# Altium schematic sheet fullCURRENT smarts micro.SchDoc
size C
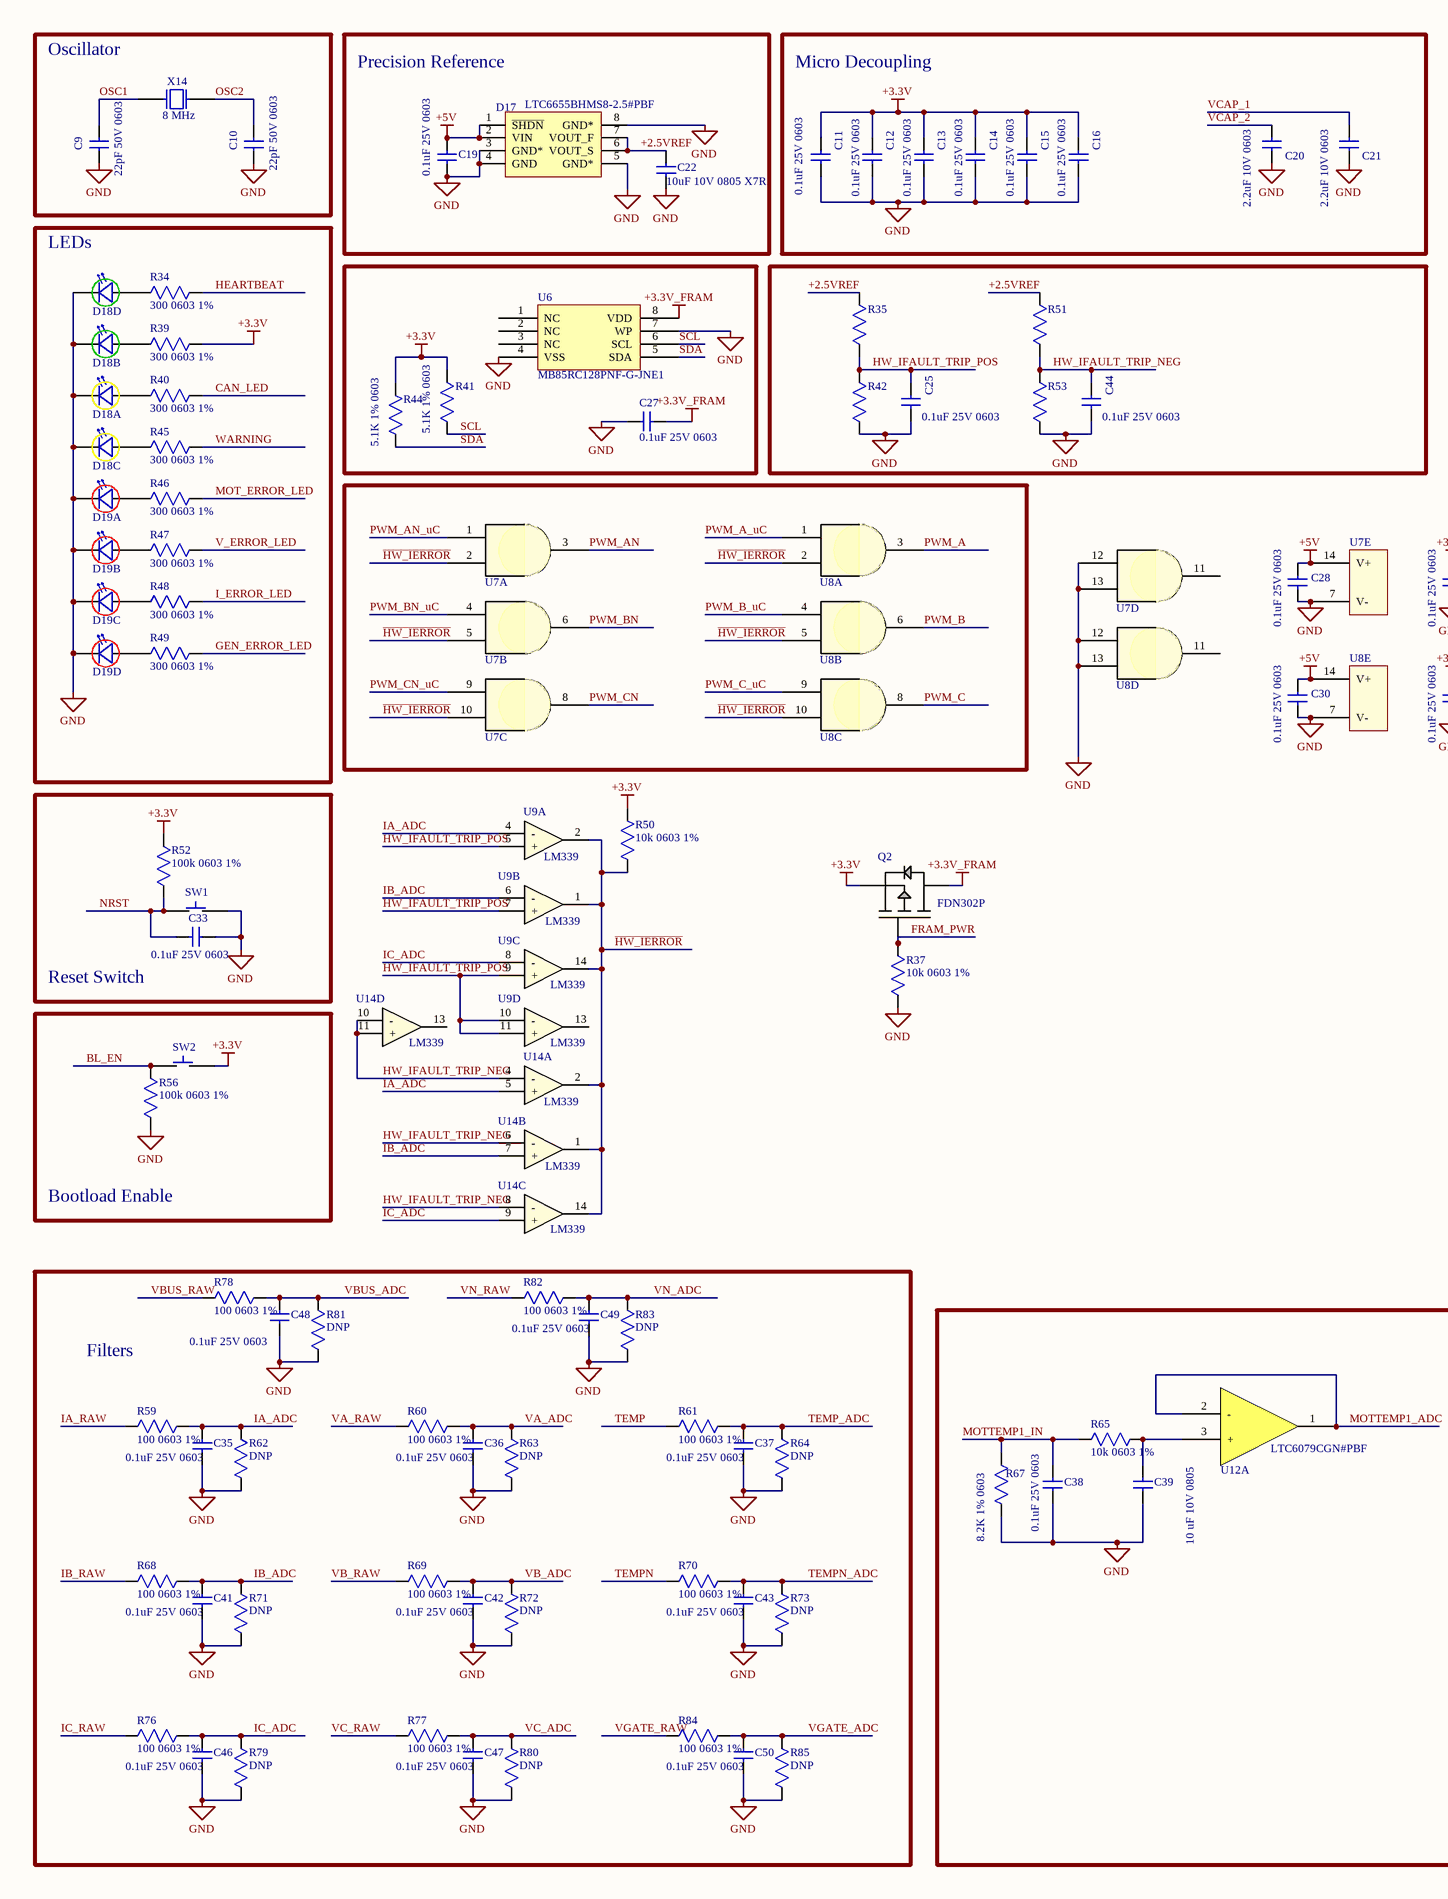
[diagram p0: fullCURRENT smarts micro.SchDoc, left]
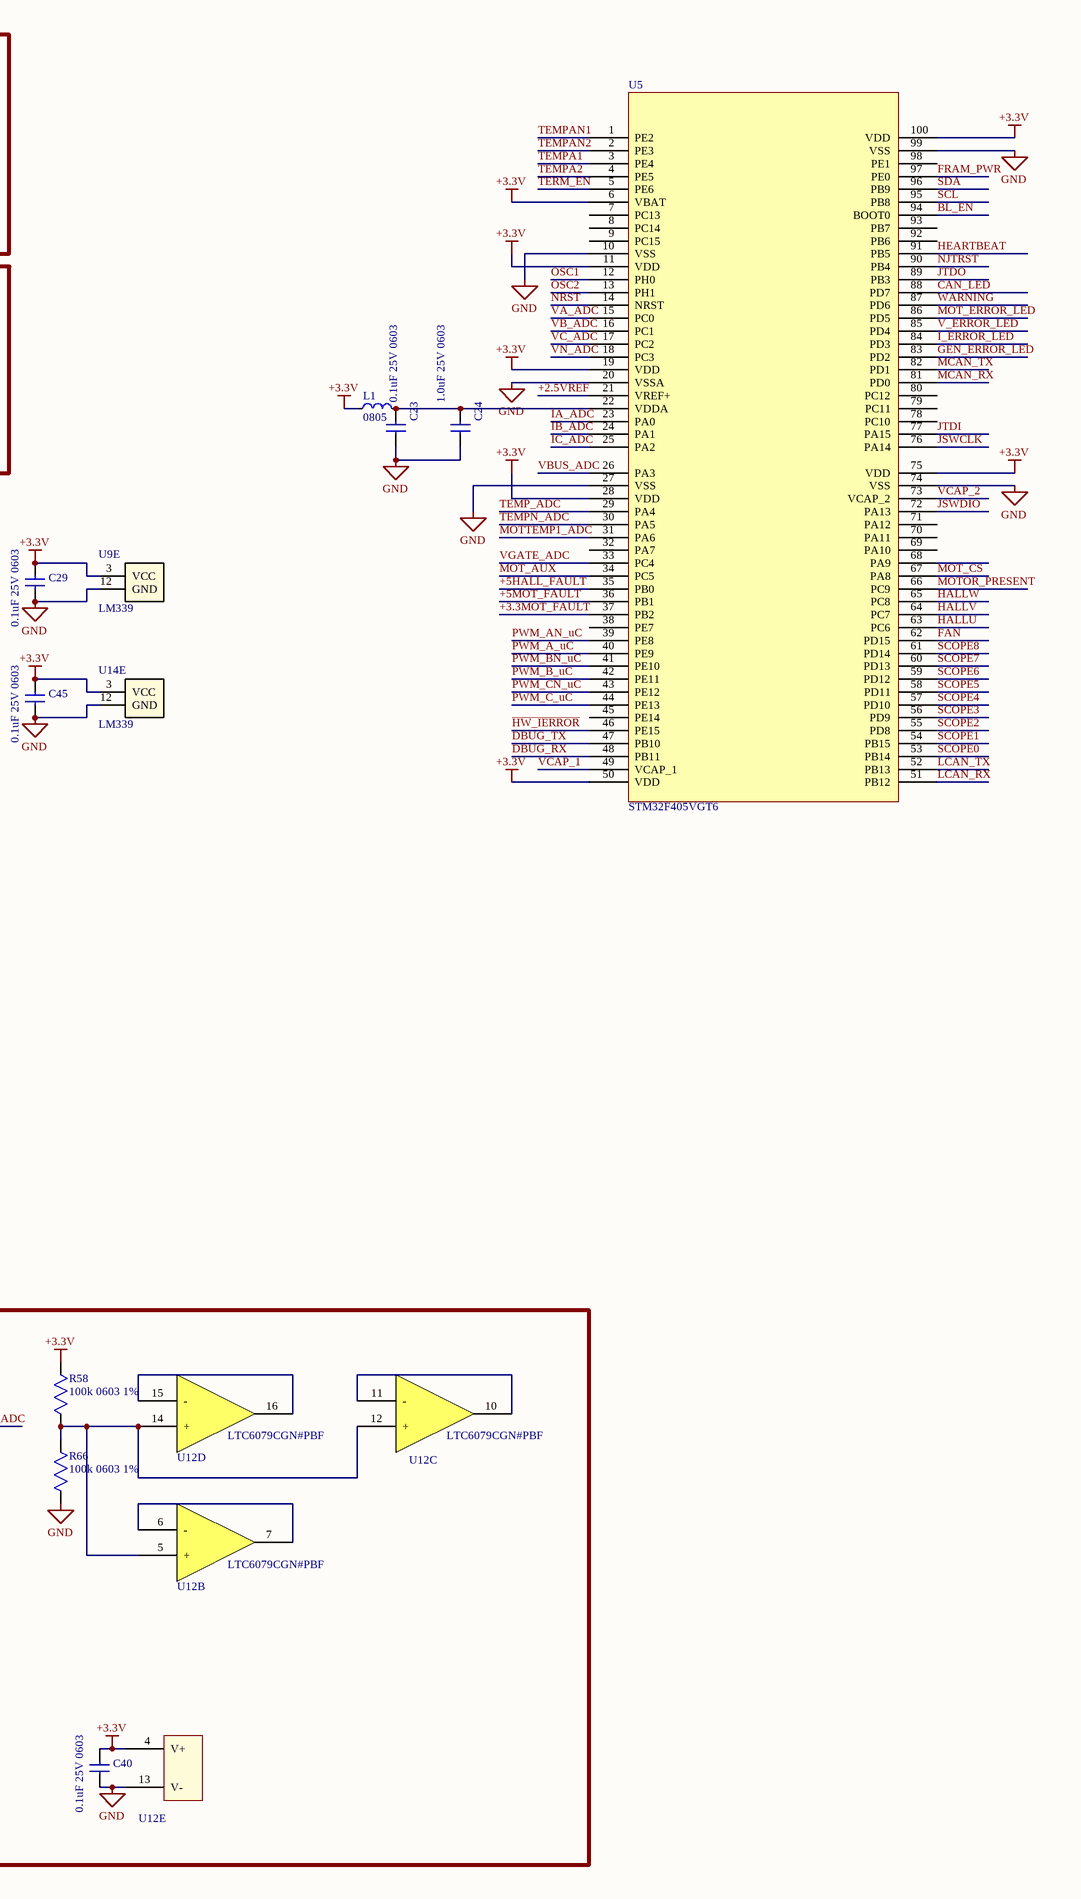
[diagram p1: fullCURRENT smarts micro.SchDoc, right]

## Parts
C9  value 22pF 50V 0603  [0603_cap]  (hidden comment: CAP 0603)
C10  value 22pF 50V 0603  [0603_cap]  (hidden comment: CAP 0603)
C11  value 0.1uF 25V 0603  [0603_cap]  (hidden comment: CAP 0603)
C12  value 0.1uF 25V 0603  [0603_cap]  (hidden comment: CAP 0603)
C13  value 0.1uF 25V 0603  [0603_cap]  (hidden comment: CAP 0603)
C14  value 0.1uF 25V 0603  [0603_cap]  (hidden comment: CAP 0603)
C15  value 0.1uF 25V 0603  [0603_cap]  (hidden comment: CAP 0603)
C16  value 0.1uF 25V 0603  [0603_cap]  (hidden comment: CAP 0603)
C19  value 0.1uF 25V 0603  [0603_cap]  (hidden comment: CAP 0603)
C20  value 2.2uF 10V 0603  [0603_cap]  (hidden comment: CAP 0603)
C21  value 2.2uF 10V 0603  [0603_cap]  (hidden comment: CAP 0603)
C22  value 10uF 10V 0805 X7R  [0805_Capacitor]  (hidden comment: CAP 0805)
C23  value 0.1uF 25V 0603  [0603_cap]  (hidden comment: CAP 0603)
C24  value 1.0uF 25V 0603  [0603_cap]  (hidden comment: CAP 0603)
C25  value 0.1uF 25V 0603  [0603_cap]  (hidden comment: CAP 0603)
C27  value 0.1uF 25V 0603  [0603_cap]  (hidden comment: CAP 0603)
C28  value 0.1uF 25V 0603  [0603_cap]  (hidden comment: CAP 0603)
C29  value 0.1uF 25V 0603  [0603_cap]  (hidden comment: CAP 0603)
C30  value 0.1uF 25V 0603  [0603_cap]  (hidden comment: CAP 0603)
C33  value 0.1uF 25V 0603  [0603_cap]  (hidden comment: CAP 0603)
C35  value 0.1uF 25V 0603  [0603_cap]  (hidden comment: CAP 0603)
C36  value 0.1uF 25V 0603  [0603_cap]  (hidden comment: CAP 0603)
C37  value 0.1uF 25V 0603  [0603_cap]  (hidden comment: CAP 0603)
C38  value 0.1uF 25V 0603  [0603_cap]  (hidden comment: CAP 0603)
C39  value 10 uF 10V 0805  [0805_Capacitor]  (hidden comment: CAP 0805)
C40  value 0.1uF 25V 0603  [0603_cap]  (hidden comment: CAP 0603)
C41  value 0.1uF 25V 0603  [0603_cap]  (hidden comment: CAP 0603)
C42  value 0.1uF 25V 0603  [0603_cap]  (hidden comment: CAP 0603)
C43  value 0.1uF 25V 0603  [0603_cap]  (hidden comment: CAP 0603)
C44  value 0.1uF 25V 0603  [0603_cap]  (hidden comment: CAP 0603)
C45  value 0.1uF 25V 0603  [0603_cap]  (hidden comment: CAP 0603)
C46  value 0.1uF 25V 0603  [0603_cap]  (hidden comment: CAP 0603)
C47  value 0.1uF 25V 0603  [0603_cap]  (hidden comment: CAP 0603)
C48  value 0.1uF 25V 0603  [0603_cap]  (hidden comment: CAP 0603)
C49  value 0.1uF 25V 0603  [0603_cap]  (hidden comment: CAP 0603)
C50  value 0.1uF 25V 0603  [0603_cap]  (hidden comment: CAP 0603)
D17  Part Number: LTC6655BHMS8-2.5#PBF  [TSOP65P490X110-8N]  (hidden comment: D_LTC6655BHMS8-2.5#PBF)
D18  D_LED_4HIGH_2GREEN_2YELLOW  [DIALIGHT 568]  (value not drawn)  (parts A,B,C,D of 4)
D19  D_LED_4HIGH_RED  [DIALIGHT 568]  (value not drawn)  (parts A,B,C,D of 4)
L1  value 0805  [0805_Resistor]
Q2  FDN302P  [SOT-23]
R34  value 300 0603 1%  [0603_res]  (hidden comment: RES 0603)
R35  RES 0603  [0603_res]  (value not drawn)
R37  value 10k 0603 1%  [0603_res]  (hidden comment: RES 0603)
R39  value 300 0603 1%  [0603_res]  (hidden comment: RES 0603)
R40  value 300 0603 1%  [0603_res]  (hidden comment: RES 0603)
R41  value 5.1K 1% 0603  [0603_res]  (hidden comment: RES 0603)
R42  RES 0603  [0603_res]  (value not drawn)
R44  value 5.1K 1% 0603  [0603_res]  (hidden comment: RES 0603)
R45  value 300 0603 1%  [0603_res]  (hidden comment: RES 0603)
R46  value 300 0603 1%  [0603_res]  (hidden comment: RES 0603)
R47  value 300 0603 1%  [0603_res]  (hidden comment: RES 0603)
R48  value 300 0603 1%  [0603_res]  (hidden comment: RES 0603)
R49  value 300 0603 1%  [0603_res]  (hidden comment: RES 0603)
R50  value 10k 0603 1%  [0603_res]  (hidden comment: RES 0603)
R51  RES 0603  [0603_res]  (value not drawn)
R52  value 100k 0603 1%  [0603_res]  (hidden comment: RES 0603)
R53  RES 0603  [0603_res]  (value not drawn)
R56  value 100k 0603 1%  [0603_res]  (hidden comment: RES 0603)
R58  value 100k 0603 1%  [0603_res]  (hidden comment: RES 0603)
R59  value 100 0603 1%  [0603_res]  (hidden comment: RES 0603)
R60  value 100 0603 1%  [0603_res]  (hidden comment: RES 0603)
R61  value 100 0603 1%  [0603_res]  (hidden comment: RES 0603)
R62  value DNP  [0603_res]  (hidden comment: RES 0603)
R63  value DNP  [0603_res]  (hidden comment: RES 0603)
R64  value DNP  [0603_res]  (hidden comment: RES 0603)
R65  value 10k 0603 1%  [0603_res]  (hidden comment: RES 0603)
R66  value 100k 0603 1%  [0603_res]  (hidden comment: RES 0603)
R67  value 8.2K 1% 0603  [0603_res]  (hidden comment: RES 0603)
R68  value 100 0603 1%  [0603_res]  (hidden comment: RES 0603)
R69  value 100 0603 1%  [0603_res]  (hidden comment: RES 0603)
R70  value 100 0603 1%  [0603_res]  (hidden comment: RES 0603)
R71  value DNP  [0603_res]  (hidden comment: RES 0603)
R72  value DNP  [0603_res]  (hidden comment: RES 0603)
R73  value DNP  [0603_res]  (hidden comment: RES 0603)
R76  value 100 0603 1%  [0603_res]  (hidden comment: RES 0603)
R77  value 100 0603 1%  [0603_res]  (hidden comment: RES 0603)
R78  value 100 0603 1%  [0603_res]  (hidden comment: RES 0603)
R79  value DNP  [0603_res]  (hidden comment: RES 0603)
R80  value DNP  [0603_res]  (hidden comment: RES 0603)
R81  value DNP  [0603_res]  (hidden comment: RES 0603)
R82  value 100 0603 1%  [0603_res]  (hidden comment: RES 0603)
R83  value DNP  [0603_res]  (hidden comment: RES 0603)
R84  value 100 0603 1%  [0603_res]  (hidden comment: RES 0603)
R85  value DNP  [0603_res]  (hidden comment: RES 0603)
SW1  SW_TACT_SWITCH_6x6  [TACT_SWITCH_6x6]  (value not drawn)
SW2  SW_TACT_SWITCH_6x6  [TACT_SWITCH_6x6]  (value not drawn)
U5  STM32F405VGT6  [STM32F405VG]
U6  MB85RC128PNF-G-JNE1  [SOIC127P600X175-8N]
U7  74LVC08AT14-13  [TSSOP-14-DIODES]  (value not drawn)  (parts A,B,C,D,E of 5)
U8  74LVC08AT14-13  [TSSOP-14-DIODES]  (value not drawn)  (parts A,B,C,D,E of 5)
U9  LM339  [SOIC127P600X175-14N]  (parts A,B,C,D,E of 5)
U12  Part Number: LTC6079CGN#PBF  [SSOP-16]  (hidden comment: U_LTC6079CGN)  (parts A,B,C,D,E of 5)
U14  LM339  [SOIC127P600X175-14N]  (parts A,B,C,D,E of 5)
X14  value 8 MHz  [HC-49]  (hidden comment: HC49)

## Blocks framed on the sheet
Oscillator: C9 C10 X14
Precision Reference: C19 C22 D17
Micro Decoupling: C11-C16 C20 C21
LEDs: D18 D19 R34 R39 R40 R45-R49
Reset Switch: C33 R52 SW1
Bootload Enable: R56 SW2
Filters: C35-C37 C41-C43 C46-C50 R59-R64 R68-R73 R76-R85

## Nets
+3.3V: C11.2 C12.2 C13.2 C14.2 C15.2 C16.2 C29.2 C40.2 C45.2 L1.1 Q2.2(SOURCE) R39.1 R41.1 R44.1 R50.1 R52.1 R58.1 SW2.2 U5.6(VBAT) U5.11(VDD) U5.19(VDD) U5.28(VDD) U5.50(VDD) U5.75(VDD) U5.100(VDD) U9.3(VCC) U12.4(V+) U14.3(VCC)
+3.3V_FRAM: C27.1 Q2.3(DRAIN) U6.8(VDD)
+5V: C19.1 C28.2 C30.2 D17.1(~{SHDN}) D17.2(VIN) U7.14(V+) U8.14(V+)
GND: C9.2 C10.2 C11.1 C12.1 C13.1 C14.1 C15.1 C16.1 C19.2 C20.2 C21.2 C22.2 C23.1 C24.1 C25.1 C27.2 C28.1 C29.1 C30.1 C33.2 C35.1 C36.1 C37.1 C38.2 C39.2 C40.1 C41.1 C42.1 C43.1 C44.1 C45.1 C46.1 C47.1 C48.1 C49.1 C50.1 D17.3(GND*) D17.4(GND) D17.5(GND*) D17.8(GND*) D18.1(Cathode) D18.3(Cathode) D18.5(Cathode) D18.7(Cathode) D19.1(Cathode) D19.3(Cathode) D19.5(Cathode) D19.7(Cathode) R37.2 R42.2 R53.2 R56.2 R62.1 R63.1 R64.1 R66.2 R67.2 R71.1 R72.1 R73.1 R79.1 R80.1 R81.1 R83.1 R85.1 SW1.2 U5.10(VSS) U5.20(VSSA) U5.27(VSS) U5.74(VSS) U5.99(VSS) U6.4(VSS) U6.7(WP) U7.7(V-) U7.12 U7.13 U8.7(V-) U8.12 U8.13 U9.12(GND) U12.13(V-) U14.12(GND)
+2.5VREF: C22.1 D17.6(VOUT_S) D17.7(VOUT_F) R35.1 R51.1 U5.21(VREF+)
+3.3MOT_FAULT: U5.37(PB2)
+5HALL_FAULT: U5.35(PB0)
+5MOT_FAULT: U5.36(PB1)
BL_EN: R56.1 SW2.1 U5.94(BOOT0)
CAN_LED: R40.1 U5.88(PD7)
DBUG_RX: U5.48(PB11)
DBUG_TX: U5.47(PB10)
FAN: U5.62(PD15)
FRAM_PWR: Q2.1(GATE) R37.1 U5.97(PE0)
GEN_ERROR_LED: R49.1 U5.83(PD2)
~{HW_IERROR}: R50.2 U5.46(PE15) U7.2 U7.5 U7.10 U8.2 U8.5 U8.10 U9.1(OUT) U9.2(OUT) U9.14(OUT) U14.1(OUT) U14.2(OUT) U14.14(OUT)
HALLU: U5.63(PC6)
HALLV: U5.64(PC7)
HALLW: U5.65(PC8)
HEARTBEAT: R34.1 U5.91(PB5)
HW_IFAULT_TRIP_NEG: C44.2 R51.2 R53.1 U14.4(-) U14.6(-) U14.8(-) U14.10(-) U14.11(+)
HW_IFAULT_TRIP_POS: C25.2 R35.2 R42.1 U9.5(+) U9.7(+) U9.9(+) U9.10(-) U9.11(+)
I_ERROR_LED: R48.1 U5.84(PD3)
IA_ADC: C35.2 R59.1 R62.2 U5.23(PA0) U9.4(-) U14.5(+)
IA_RAW: R59.2
IB_ADC: C41.2 R68.1 R71.2 U5.24(PA1) U9.6(-) U14.7(+)
IB_RAW: R68.2
IC_ADC: C46.2 R76.1 R79.2 U5.25(PA2) U9.8(-) U14.9(+)
IC_RAW: R76.2
JSWCLK: U5.76(PA14)
JSWDIO: U5.72(PA13)
JTDI: U5.77(PA15)
JTDO: U5.89(PB3)
LCAN_RX: U5.51(PB12)
LCAN_TX: U5.52(PB13)
MCAN_RX: U5.81(PD0)
MCAN_TX: U5.82(PD1)
MOT_AUX: U5.34(PC5)
MOT_CS: U5.67(PA8)
MOT_ERROR_LED: R46.1 U5.86(PD5)
MOTOR_PRESENT: U5.66(PC9)
MOTTEMP1_ADC: U5.31(PA6) U12.1 U12.2(-)
MOTTEMP1_IN: C38.1 R65.2 R67.1
NJTRST: U5.90(PB4)
NRST: C33.1 R52.2 SW1.1 U5.14(NRST)
OSC1: C9.1 U5.12(PH0) X14.1
OSC2: C10.1 U5.13(PH1) X14.2
PWM_A: U8.3
PWM_A_uC: U5.40(PE9) U8.1
PWM_AN: U7.3
PWM_AN_uC: U5.39(PE8) U7.1
PWM_B: U8.6
PWM_B_uC: U5.42(PE11) U8.4
PWM_BN: U7.6
PWM_BN_uC: U5.41(PE10) U7.4
PWM_C: U8.8
PWM_C_uC: U5.44(PE13) U8.9
PWM_CN: U7.8
PWM_CN_uC: U5.43(PE12) U7.9
SCL: R41.2 U5.95(PB8) U6.6(SCL)
SCOPE0: U5.53(PB14)
SCOPE1: U5.54(PB15)
SCOPE2: U5.55(PD8)
SCOPE3: U5.56(PD9)
SCOPE4: U5.57(PD10)
SCOPE5: U5.58(PD11)
SCOPE6: U5.59(PD12)
SCOPE7: U5.60(PD13)
SCOPE8: U5.61(PD14)
SDA: R44.2 U5.96(PB9) U6.5(SDA)
TEMP: R61.2
TEMP_ADC: C37.2 R61.1 R64.2 U5.29(PA4)
TEMPA1: U5.3(PE4)
TEMPA2: U5.4(PE5)
TEMPAN1: U5.1(PE2)
TEMPAN2: U5.2(PE3)
TEMPN: R70.2
TEMPN_ADC: C43.2 R70.1 R73.2 U5.30(PA5)
TERM_EN: U5.5(PE6)
V_ERROR_LED: R47.1 U5.85(PD4)
VA_ADC: C36.2 R60.1 R63.2 U5.15(PC0)
VA_RAW: R60.2
VB_ADC: C42.2 R69.1 R72.2 U5.16(PC1)
VB_RAW: R69.2
VBUS_ADC: C48.2 R78.1 R81.2 U5.26(PA3)
VBUS_RAW: R78.2
VC_ADC: C47.2 R77.1 R80.2 U5.17(PC2)
VC_RAW: R77.2
VCAP_1: C21.1 U5.49(VCAP_1)
VCAP_2: C20.1 U5.73(VCAP_2)
VGATE_ADC: C50.2 R84.1 R85.2 U5.33(PC4)
VGATE_RAW: R84.2
VN_ADC: C49.2 R82.1 R83.2 U5.18(PC3)
VN_RAW: R82.2
WARNING: R45.1 U5.87(PD6)
NetC23_2: C23.2 C24.2 L1.2 U5.22(VDDA)
NetC39_1: C39.1 R65.1 U12.3(+)
NetD18_2: D18.2(Anode) R40.2
NetD18_4: D18.4(Anode) R39.2
NetD18_6: D18.6(Anode) R45.2
NetD18_8: D18.8(Anode) R34.2
NetD19_2: D19.2(Anode) R46.2
NetD19_4: D19.4(Anode) R47.2
NetD19_6: D19.6(Anode) R48.2
NetD19_8: D19.8(Anode) R49.2
NetR58_2: R58.2 R66.1 U12.5(+) U12.12(+) U12.14(+)
NetU12_6: U12.6(-) U12.7
NetU12_10: U12.10 U12.11(-)
NetU12_15: U12.15(-) U12.16

Not connected (* = marked no-connect by the designer): U5 7(PC13) 8(PC14) 9(PC15) 32(PA7) 38(PE7) 45(PE14) 68(PA9) 69(PA10) 70(PA11) 71(PA12) 78(PC10) 79(PC11) 80(PC12) 92(PB6) 93(PB7) 98(PE1); U6 1(NC) 2(NC) 3(NC); U7 11; U8 11; U9 13(OUT); U14 13(OUT)

## Library data of the parts
C9 C10 = C_0603: CAP CER 22PF 50V 5% NPO 0603; Supplier 1: Digi-Key; Supplier Part Number 1: 445-1273-1-ND
C11-C16 C23 C25 C28-C30 C33 C40 C44 C45 = C_0603: CAP CER 0.1UF 25V X7R 0603; Part Number: GRM188R71E104KA01D; Supplier Part Number 1: 490-1524-1-ND; Supplier 1: Digi-Key
C19 C27 C35-C37 C41-C43 C46-C50 = C_0603: CAP CER 0.1UF 25V X7R 0603; Supplier Part Number 1: 490-1524-1-ND; Supplier 1: Digi-Key
C20 C21 = C_0603: CAP CER 2.2UF 10V 10% X7R 0603; Manufacturer: Taiyo Yuden; Part Number: LMK107B7225KA-T; Supplier 1: Digi-Key; Supplier Part Number 1: 587-2983-1-ND
C22 = C_0805: CAP CERM 0805; Supplier 1: Digi-Key; Supplier Part Number 1: 587-2668-1-ND
C24 = C_0603: CAP CER 1.0UF 25V 10% X7R 0603; Supplier 1: Digi-Key; Supplier Part Number 1: 587-2984-1-ND
C38 = C_0603: CAP CER 0.1UF 25V X7R 0603; Manufacturer PN: CC0603KRX7R9BB104; Distributor: Digikey; Supplier Part Number 1: 490-1524-1-ND; Supplier 1: Digi-Key
C39 = C_0805: CAP CER 10UF 10V 10% X5R 0805; Manufacturer: Taiyo Yuden; Manufacturer PN: LMK212BJ106KG-T; Distributor: Digikey; Supplier 1: Digi-Key; Supplier Part Number 1: 587-1300-1-ND
D17 = D_LTC6655BHMS8-3.3#PBF: IC VREF SERIES PREC 2.5V 8-MSOP; Manufacturer: Linear Technology; Supplier 1: Digi-Key; Supplier Part Number 1: LTC6655BHMS8-2.5#PBF-ND
D18 = D_LED_4HIGH_2GREEN_2YELLOW: LED 4HI 3MM GRN/YEL/GRN/YEL PCMT; Part Number: 568-0102-323F; Manufacturer: Dialight; Supplier 1: Digi-Key; Supplier Part Number 1: 350-1769-ND
D19 = D_LED_4HIGH_RED: LED 4HI 3MM 5V RED PC MNT; Part Number: 568-0301-111F; Manufacturer: Dialight; Supplier 1: Digi-Key; Supplier Part Number 1: 350-1774-ND
L1 = L_1mH_10%: FERRITE 0603; Supplier 1: Digi-Key; Supplier Part Number 1: 445-2205-1-ND
Q2 = Q_FDN302P: MOSFET P-CH 20V 2.4A SSOT3; Manufacturer: Fairchild Semiconductor; SVP Creator: Adam Shea; SVP Reviewer 1: Nate Bolyard; SVP Reviewer 2: Trevtron; Package: SOT-23; Known Distributors: Digikey, Newark; Manufacturer PN: FDN302P; ComponentLink1URL: http://umnsvp.dyndns.org/svn/centaurus2/datasheets/Common Board/FDN302P.pdf; ComponentLink1Description: Datasheet; HelpURL: http://umnsvp.dyndns.org/svn/centaurus2/datasheets/Common Board/FDN302P.pdf; Value: FDN302P
R34 R39 R40 R45-R49 = R_0603: RES 300 0603 1%; Supplier 1: Digi-Key; Supplier Part Number 1: 311-300HRCT-ND
R35 R42 R51 R53 = R_0603: RES DNP 0603 0.1%
R37 R50 R65 = R_0603: RES 10K 0603 1%; Supplier 1: Digi-Key; Supplier Part Number 1: 311-10.0KHRCT-ND
R41 R44 = R_0603: RES 5.1K 1% 0603; Supplier 1: Digi-Key; Supplier Part Number 1: 311-5.10KCRCT-ND
R52 R56 R58 R66 = R_0603: RES 100K 0603 1%; Supplier 1: Digi-Key; Supplier Part Number 1: 311-100KHRCT-ND
R59-R61 R68-R70 R76-R78 R82 R84 = R_0603: RES 100 0603 1%; Supplier 1: Digi-Key; Supplier Part Number 1: 311-100HRCT-ND
R62-R64 R71-R73 R79-R81 R83 R85 = R_0603: RES 0603 DNP
R67 = R_0603: RES 8.2K 1% 0603; Supplier 1: Digi-Key; Supplier Part Number 1: 311-8.20KHRCT-ND
SW1 SW2 = SW_TACT_SWITCH_6x6: SWITCH TACTILE SPST-NO 0.05A 12V; Manufacturer: C&K Components; Part Number: PTS645SK43 LFS; Supplier 1: Digi-Key; Supplier Part Number 1: CKN9090-ND
U5 = U_STM32F405VGT6: IC MCU 32BIT 1MB FLASH 100LQFP; Manufacturer: STMicroelectronics; Part Number: STM32F405VGT6; Supplier 1: Digi-Key; Supplier Part Number 1: 497-11910-ND
U6 = U_MB85RC16PNF-G-JNE1: IC FRAM 128KBIT 400KHZ 8SOP; Manufacturer: Fujitsu Semiconductor America Inc; Package: SOIC-8; Part Number: MB85RC128PNF-G-JNE1; Supplier 1: Digi-Key; Supplier Part Number 1: 865-1172-ND
U7 U8 = U_74LVC08AT14-13: IC QUAD 2-IN AND GATE 14TSSOP; Manufacturer: Diodes, Inc.; Part Number: 74LVC08AT14-13; Supplier 1: Digi-Key; Supplier Part Number 1: 74LVC08AT14-13DICT-ND
U12 = U_LTC6079CGN: IC OP AMP QUAD R-R I/O 16SSOP; Manufacturer: LT; Supplier 1: Digi-Key; Supplier Part Number 1: LTC6079CGN#PBF-ND
X14 = X_HC49: CRYSTAL 8.0 MHZ 20PF; Part Number: FOXSLF/080-20; Manufacturer: Fox Electronics; Supplier 1: Digi-Key; Supplier Part Number 1: 631-1100-ND
U9 U14 = LM339: Supplier 1: Digi-Key; Supplier Part Number 1: 497-1588-1-ND